# Altium project AES50.PrjPcb
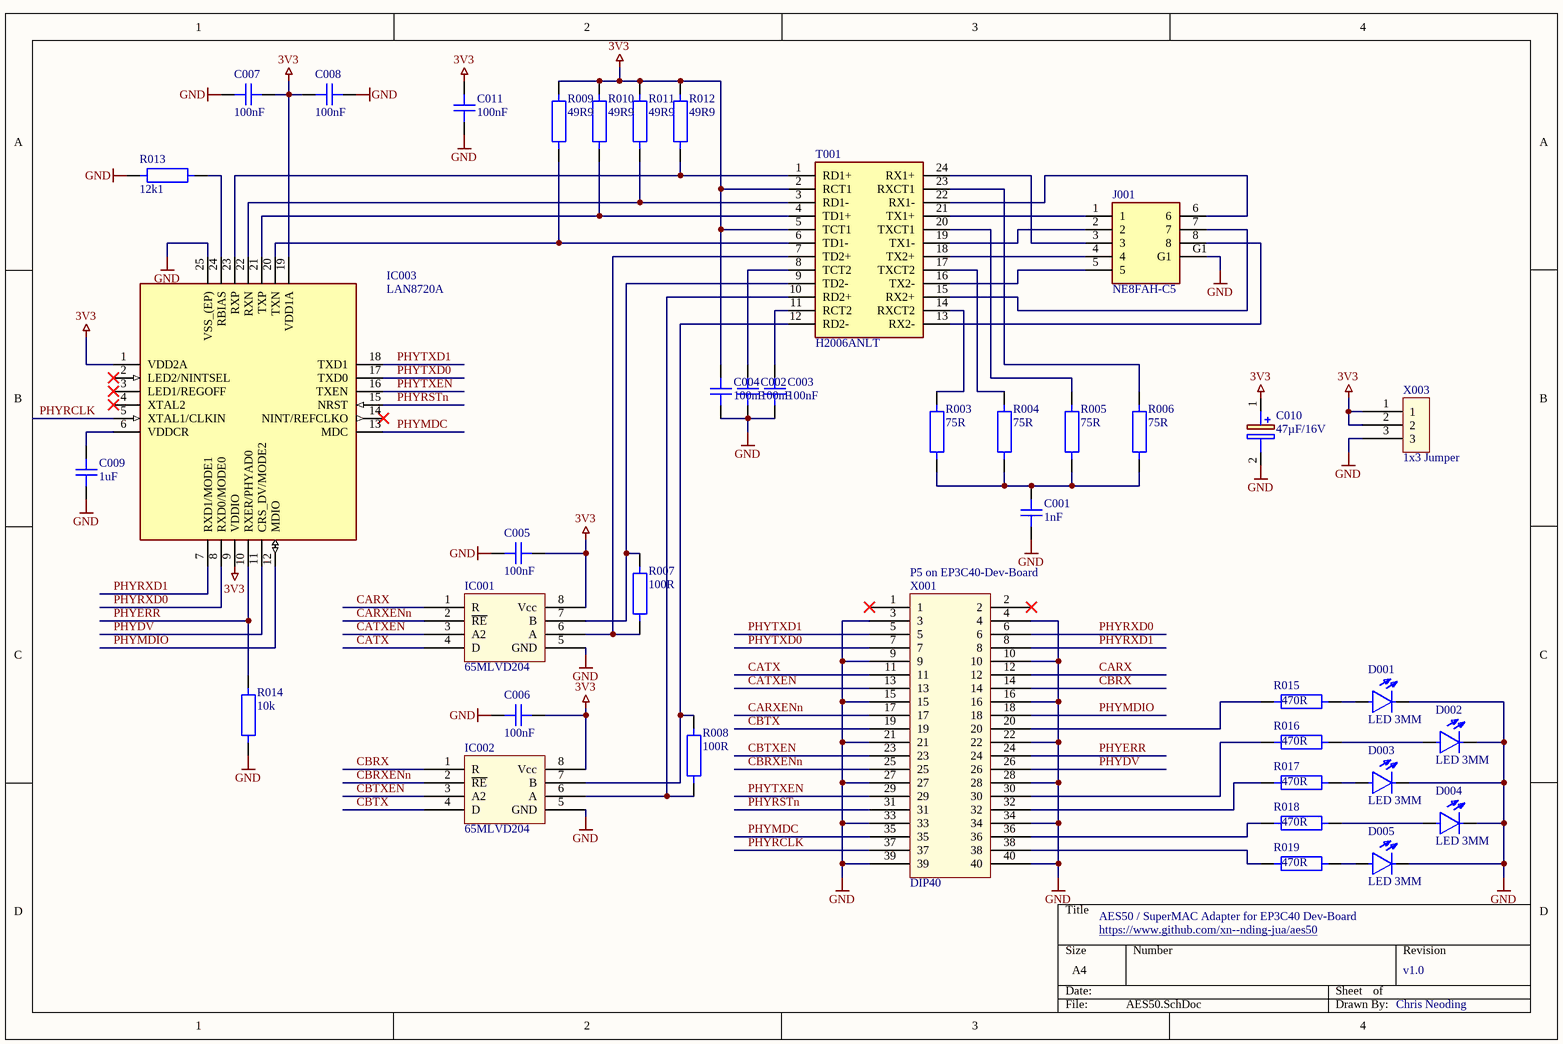
[diagram p0: AES50.SchDoc]
2 sheets, 56 parts. Net scope: global (net labels, ports and power ports of the same name join across sheets).
Board file: AES50.PcbDoc
Sheets:
  AES50.SchDoc
  AES50B.SchDoc

## Sheet AES50.SchDoc
size A4; SheetNumber: 1; SheetTotal: 2

### Parts
C001  1nF  [1206]
C002  100nF  [1206]
C003  100nF  [1206]
C004  100nF  [1206]
C005  100nF  [1206]
C006  100nF  [1206]
C007  100nF  [1206]
C008  100nF  [1206]
C009  1uF  [1206]
C010  47µF/16V  [CAPPRD200W50D550H1250]
C011  100nF  [1206]
D001  LED 3MM  [LED 3MM]
D002  LED 3MM  [LED 3MM]
D003  LED 3MM  [LED 3MM]
D004  LED 3MM  [LED 3MM]
D005  LED 3MM  [LED 3MM]
IC001  65MLVD204  [SOIC-8]
IC002  65MLVD204  [SOIC-8]
IC003  LAN8720A  [QFN50P400X400X100-25N-D]
J001  NE8FAH-C5  [NE8FAHC5]
R003  75R  [1206]
R004  75R  [1206]
R005  75R  [1206]
R006  75R  [1206]
R007  100R  [1206]
R008  100R  [1206]
R009  49R9  [1206]
R010  49R9  [1206]
R011  49R9  [1206]
R012  49R9  [1206]
R013  12k1  [1206]
R014  10k  [1206]
R015  470R  [1206]
R016  470R  [1206]
R017  470R  [1206]
R018  470R  [1206]
R019  470R  [1206]
T001  H2006ANLT  [H2006ANLT]
X001  DIP40  [DIP40]
X003  1x3 Jumper  [1x3 Jumper]

### Nets
3V3: C004.1 C005.1 C006.1 C007.1 C008.1 C010.1(+) C011.1 IC001.8(Vcc) IC002.8(Vcc) IC003.1(VDD2A) IC003.9(VDDIO) IC003.19(VDD1A) R009.2 R010.2 R011.2 R012.2 T001.2(RCT1) T001.5(TCT1) X003.1 X003.2
GND: C001.2 C002.2 C003.2 C004.2 C005.2 C006.2 C007.2 C008.2 C009.2 C010.2(-) C011.2 D001.2 D002.2 D003.2 D004.2 D005.2 IC001.5(GND) IC002.5(GND) IC003.25(VSS_(EP)) J001.G1 R013.1 R014.1 X001.3 X001.4 X001.9 X001.10 X001.15 X001.16 X001.21 X001.22 X001.27 X001.28 X001.33 X001.34 X001.39 X001.40 X003.3
CARX: IC001.1(R) X001.12
CARXENn: IC001.2(~{RE}) X001.17
CATX: IC001.4(D) X001.11
CATXEN: IC001.3(A2) X001.13
CBRX: IC002.1(R) X001.14
CBRXENn: IC002.2(~{RE}) X001.25
CBTX: IC002.4(D) X001.19
CBTXEN: IC002.3(A2) X001.23
PHYDV: IC003.11(CRS_DV/MODE2) X001.26
PHYERR: IC003.10(RXER/PHYAD0) R014.2 X001.24
PHYMDC: IC003.13(MDC) X001.35
PHYMDIO: IC003.12(MDIO) X001.18
PHYRCLK: IC003.5(XTAL1/CLKIN) X001.37
PHYRSTn: IC003.15(NRST) X001.31
PHYRXD0: IC003.8(RXD0/MODE0) X001.6
PHYRXD1: IC003.7(RXD1/MODE1) X001.8
PHYTXD0: IC003.17(TXD0) X001.7
PHYTXD1: IC003.18(TXD1) X001.5
PHYTXEN: IC003.16(TXEN) X001.29
NetC001_1: C001.1 R003.1 R004.1 R005.1 R006.1
NetC002_1: C002.1 T001.8(TCT2)
NetC003_1: C003.1 T001.11(RCT2)
NetC009_1: C009.1 IC003.6(VDDCR)
NetD001_1: D001.1 R015.1
NetD002_1: D002.1 R016.1
NetD003_1: D003.1 R017.1
NetD004_1: D004.1 R018.1
NetD005_1: D005.1 R019.1
NetIC001_6: IC001.6(A) R007.1 T001.7(TD2+)
NetIC001_7: IC001.7(B) R007.2 T001.9(TD2-)
NetIC002_6: IC002.6(A) R008.1 T001.10(RD2+)
NetIC002_7: IC002.7(B) R008.2 T001.12(RD2-)
NetIC003_20: IC003.20(TXN) R009.1 T001.6(TD1-)
NetIC003_21: IC003.21(TXP) R010.1 T001.4(TD1+)
NetIC003_22: IC003.22(RXN) R011.1 T001.3(RD1-)
NetIC003_23: IC003.23(RXP) R012.1 T001.1(RD1+)
NetIC003_24: IC003.24(RBIAS) R013.2
NetJ001_1: J001.1 T001.21(TX1+)
NetJ001_2: J001.2 T001.19(TX1-)
NetJ001_3: J001.3 T001.24(RX1+)
NetJ001_4: J001.4 T001.18(TX2+)
NetJ001_5: J001.5 T001.16(TX2-)
NetJ001_6: J001.6 T001.22(RX1-)
NetJ001_7: J001.7 T001.15(RX2+)
NetJ001_8: J001.8 T001.13(RX2-)
NetR003_2: R003.2 T001.14(RXCT2)
NetR004_2: R004.2 T001.17(TXCT2)
NetR005_2: R005.2 T001.20(TXCT1)
NetR006_2: R006.2 T001.23(RXCT1)
NetR015_2: R015.2 X001.20
NetR016_2: R016.2 X001.30
NetR017_2: R017.2 X001.32
NetR018_2: R018.2 X001.36
NetR019_2: R019.2 X001.38

Not connected (* = marked no-connect by the designer): IC003 2(LED2/NINTSEL)* 3(LED1/REGOFF)* 4(XTAL2)* 14(NINT/REFCLKO)*; X001 1* 2*

### Notes on the sheet
- P5 on EP3C40-Dev-Board
- AES50 / SuperMAC Adapter for EP3C40 Dev-Board
- https://www.github.com/xn--nding-jua/aes50
- v1.0
- Chris Neoding

### Library data of the parts
C001 C002 C003 C004 C005 C006 C007 C008 C009 C011 = 1206_C_1nF/63V: 1206_C; Text Field1: 06-23225; SMA-ArtikelNr: *
C010 = MAL214256479E3: Capacitor Polarised; Manufacturer_Name: Vishay; Datasheet Link: https://www.vishay.com/docs/28402/142rhs.pdf; Height: 12.5mm; Manufacturer_Part_Number: MAL214256479E3
IC003 = LAN8720A: Integrated Circuit; Manufacturer_Name: Microchip; Datasheet Link: http://ww1.microchip.com/downloads/en/DeviceDoc/8720a.pdf; Height: 1mm; Manufacturer_Part_Number: LAN8720A
J001 = NE8FAH-C5: Connector; Manufacturer_Name: Neutrik; Datasheet Link: https://www.neutrik.com/media/10049/download/ne8fah-c5-1.pdf?v=1; Height: 28.7mm; Manufacturer_Part_Number: NE8FAH-C5; Mouser Part Number: 568-NE8FAH-C5; Mouser Price/Stock: https://www.mouser.co.uk/ProductDetail/Neutrik/NE8FAH-C5?qs=yAJ577jGV73mSHthIeMdNw%3D%3D
R003 R004 R005 R006 R007 R008 R009 R010 R011 R012 R013 R014 R015 R016 R017 R018 R019 = 1206_R: SMA-ArtikelNr: *
T001 = H2006ANLT: Transformer; Manufacturer_Name: Pulse Electronics; Datasheet Link: https://componentsearchengine.com/Datasheets/1/H2006ANLT.pdf; Height: 6.22mm; Manufacturer_Part_Number: H2006ANLT; Mouser Part Number: 673-H2006ANLT; Mouser Price/Stock: https://www.mouser.co.uk/ProductDetail/Pulse-Electronics/H2006ANLT?qs=4b8myOmUP%252Bsybzhc9Gv5ow%3D%3D; Arrow Part Number: H2006ANLT; Arrow Price/Stock: https://www.arrow.com/en/products/h2006anlt/pulse-electronics-corporation?region=nac

## Sheet AES50B.SchDoc
size A4; SheetNumber: 2; SheetTotal: 2
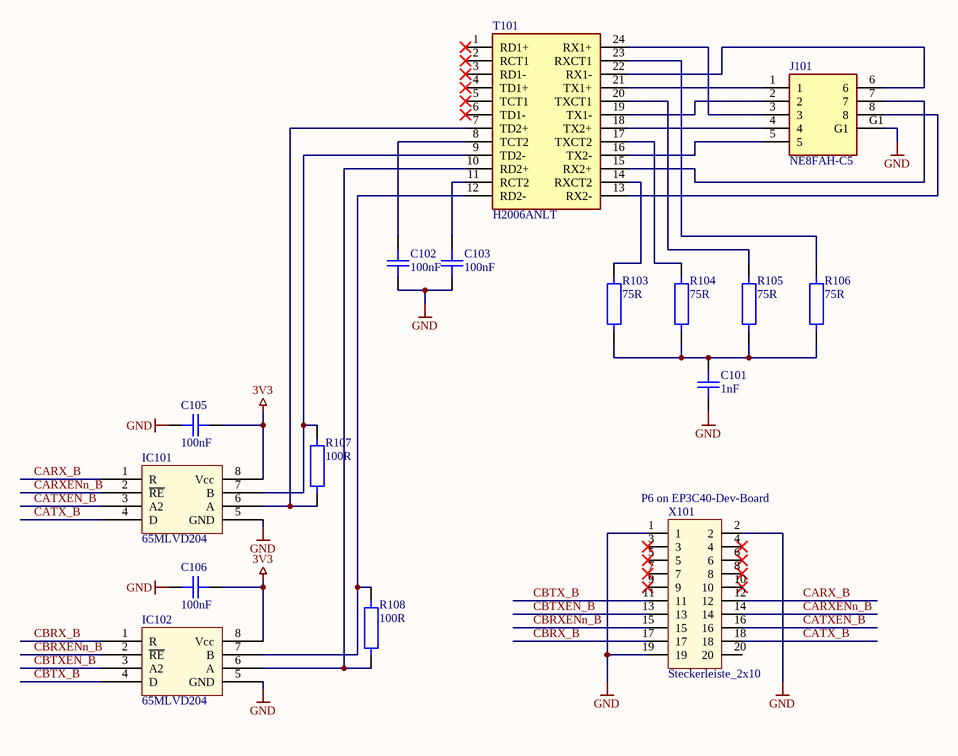
[diagram p1: AES50B.SchDoc]

### Parts
C101  1nF  [1206]
C102  100nF  [1206]
C103  100nF  [1206]
C105  100nF  [1206]
C106  100nF  [1206]
IC101  65MLVD204  [SOIC-8]
IC102  65MLVD204  [SOIC-8]
J101  NE8FAH-C5  [NE8FAHC5]
R103  75R  [1206]
R104  75R  [1206]
R105  75R  [1206]
R106  75R  [1206]
R107  100R  [1206]
R108  100R  [1206]
T101  H2006ANLT  [H2006ANLT]
X101  Steckerleiste_2x10  [steckerleiste_2x10]

### Nets
3V3: C105.1 C106.1 IC101.8(Vcc) IC102.8(Vcc)
GND: C101.2 C102.2 C103.2 C105.2 C106.2 IC101.5(GND) IC102.5(GND) J101.G1 X101.1 X101.2 X101.19
CARX_B: IC101.1(R) X101.12
CARXENn_B: IC101.2(~{RE}) X101.14
CATX_B: IC101.4(D) X101.18
CATXEN_B: IC101.3(A2) X101.16
CBRX_B: IC102.1(R) X101.17
CBRXENn_B: IC102.2(~{RE}) X101.15
CBTX_B: IC102.4(D) X101.11
CBTXEN_B: IC102.3(A2) X101.13
NetC101_1: C101.1 R103.1 R104.1 R105.1 R106.1
NetC102_1: C102.1 T101.8(TCT2)
NetC103_1: C103.1 T101.11(RCT2)
NetIC101_6: IC101.6(A) R107.1 T101.7(TD2+)
NetIC101_7: IC101.7(B) R107.2 T101.9(TD2-)
NetIC102_6: IC102.6(A) R108.1 T101.10(RD2+)
NetIC102_7: IC102.7(B) R108.2 T101.12(RD2-)
NetJ101_1: J101.1 T101.21(TX1+)
NetJ101_2: J101.2 T101.19(TX1-)
NetJ101_3: J101.3 T101.24(RX1+)
NetJ101_4: J101.4 T101.18(TX2+)
NetJ101_5: J101.5 T101.16(TX2-)
NetJ101_6: J101.6 T101.22(RX1-)
NetJ101_7: J101.7 T101.15(RX2+)
NetJ101_8: J101.8 T101.13(RX2-)
NetR103_2: R103.2 T101.14(RXCT2)
NetR104_2: R104.2 T101.17(TXCT2)
NetR105_2: R105.2 T101.20(TXCT1)
NetR106_2: R106.2 T101.23(RXCT1)

Not connected (* = marked no-connect by the designer): T101 1(RD1+)* 2(RCT1)* 3(RD1-)* 4(TD1+)* 5(TCT1)* 6(TD1-)*; X101 3* 4* 5* 6* 7* 8* 9* 10* 20

### Notes on the sheet
- (near X101) P6 on EP3C40-Dev-Board

### Library data of the parts
C101-C103 C105 C106 = 1206_C_1nF/63V: 1206_C; Text Field1: 06-23225; SMA-ArtikelNr: *
J101 = NE8FAH-C5: Connector; Manufacturer_Name: Neutrik; Datasheet Link: https://www.neutrik.com/media/10049/download/ne8fah-c5-1.pdf?v=1; Height: 28.7mm; Manufacturer_Part_Number: NE8FAH-C5; Mouser Part Number: 568-NE8FAH-C5; Mouser Price/Stock: https://www.mouser.co.uk/ProductDetail/Neutrik/NE8FAH-C5?qs=yAJ577jGV73mSHthIeMdNw%3D%3D
R103-R108 = 1206_R: SMA-ArtikelNr: *
T101 = H2006ANLT: as T001 on sheet AES50; Datasheet Link: https://componentsearchengine.com/Datasheets/1/H2006ANLT.pdf; Height: 6.22mm; Manufacturer_Part_Number: H2006ANLT; Mouser Part Number: 673-H2006ANLT; Mouser Price/Stock: https://www.mouser.co.uk/ProductDetail/Pulse-Electronics/H2006ANLT?qs=4b8myOmUP%252Bsybzhc9Gv5ow%3D%3D; Arrow Part Number: H2006ANLT; Arrow Price/Stock: https://www.arrow.com/en/products/h2006anlt/pulse-electronics-corporation?region=nac

## Nets that join several sheets
3V3: AES50 (20 pins), AES50B (C105.1 C106.1 IC101.8 IC102.8)
GND: AES50 (37 pins), AES50B (11 pins)